# Altium schematic sheet 3.3V_PS.SchDoc
size A
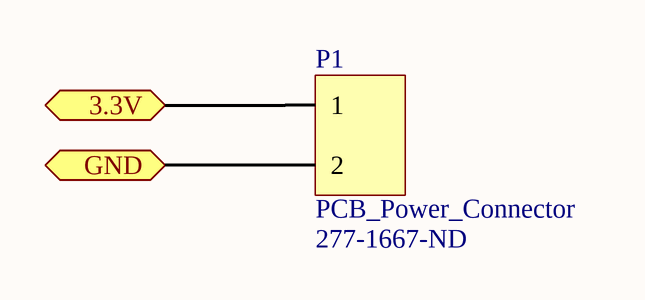
[diagram p0: 3.3V_PS.SchDoc]

## Parts
P1  PCB_Power_Connector  Supplier Part Number 1: 277-1667-ND  [Power_Connector]

## Ports
3.3V (bidir), GND (bidir)

## Nets
3.3V: P1.1 ; port 3.3V
GND: P1.2 ; port GND

## Library data of the parts
P1 = PCB_Power_Connector: Manufacturer: Phoenix Contact; Manufacturer Part Number: PT1,5/2-5.0-H; Max Current Rating: 16A; Max Supply Voltage: 250V; Current Rating: 17.5A; Number of Poles: 2; Number of Levels: 1; Current: 18A; Voltage: 300V; Voltage Rating (DC): 320V; Connector Type: Screw; Wire Gauge (Max): 26AWG; Wire Gauge (Min): 12AWG; Pitch: 5mm; Wire/Cable Gauge: 14AWG; Approvals: UL; Supplier 1: Digi-Key; Stock 1: 104404; Pricing 1: 1=0.43, 10=0.411, 50=0.3928, 100=0.382, 250=0.357, 500=0.3284, 1000=0.3035 (USD); Mount: Through Hole; Number of Pins: 2; Weight: 0.067021oz; Color: Green; Material: Nylon; Housing Color: Green; Housing Material: Polyamide; Insulation Material: Nylon; Contact Material: Copper,Tin; Number of Rows: 1; Voltage Rating: 250V; Package Quantity: 250; Packaging: Bulk; Number of Positions: 2; Number of Positions Per Level: 2; Termination: Solder; Number of Contacts: 2; Number of Circuits: 2; Orientation: Straight; Length: 9mm; Height: 11.3mm; Width: 14.9mm; Depth: 9mm; Radiation Hardening: No; Lead Free: Lead Free; Flammability Rating: UL94 V-0; ComponentLink1URL: https://media.digikey.com/pdf/Data%20Sheets/Phoenix%20Contact%20PDFs/1935161.pdf; ComponentLink1Description: https://media.digikey.com/pdf/Data%20Sheets/Phoenix%20Contact%20PDFs/1935161.pdf; ComponentLink2URL: https://www.verical.com/server-webapp/html/getDatasheet?partID=177903; ComponentLink2Description: https://www.verical.com/server-webapp/html/getDatasheet?partID=177903